# EAGLE board Adafruit Feather M0 RFMxx (EAGLE 9.6.2)
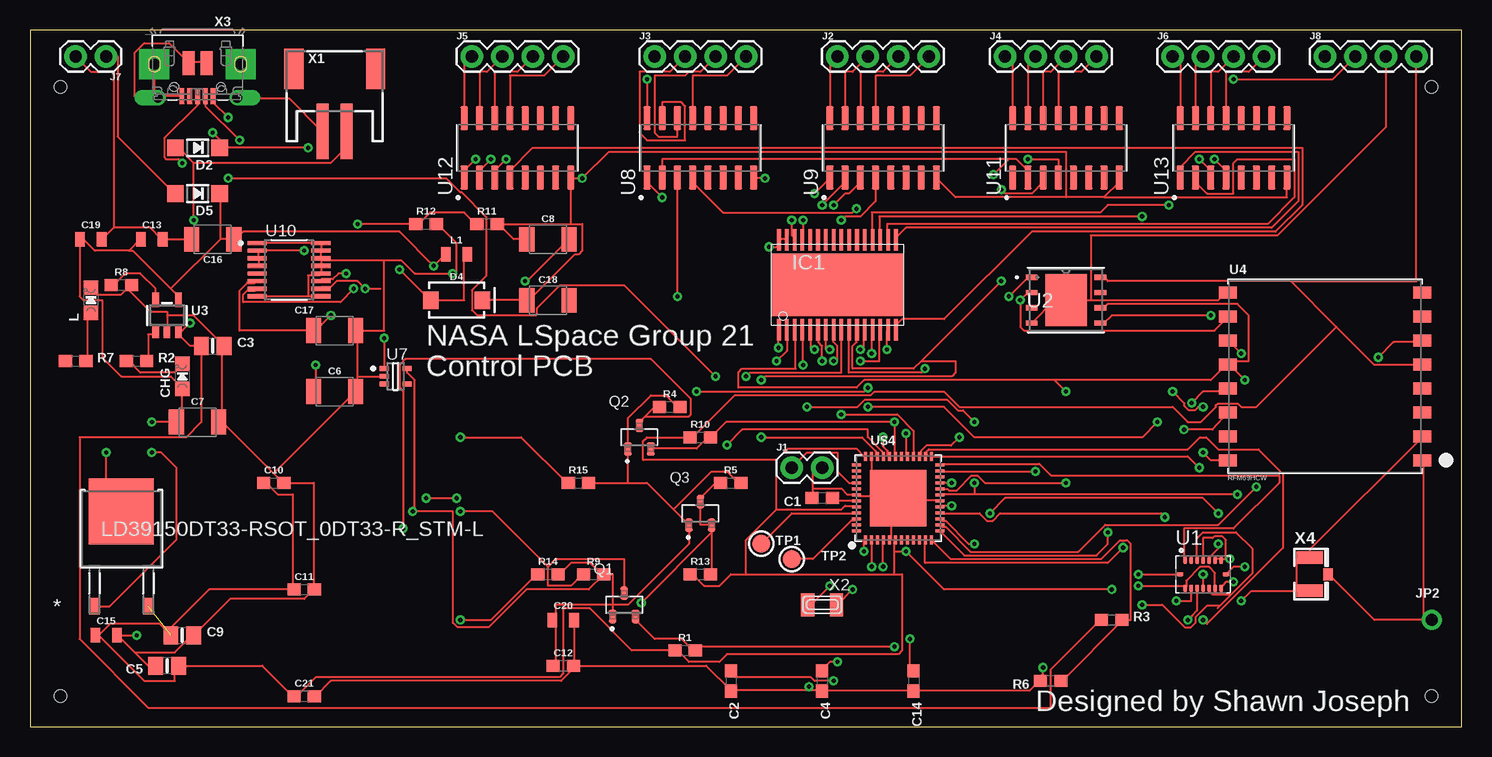
[diagram p1: board, top side]
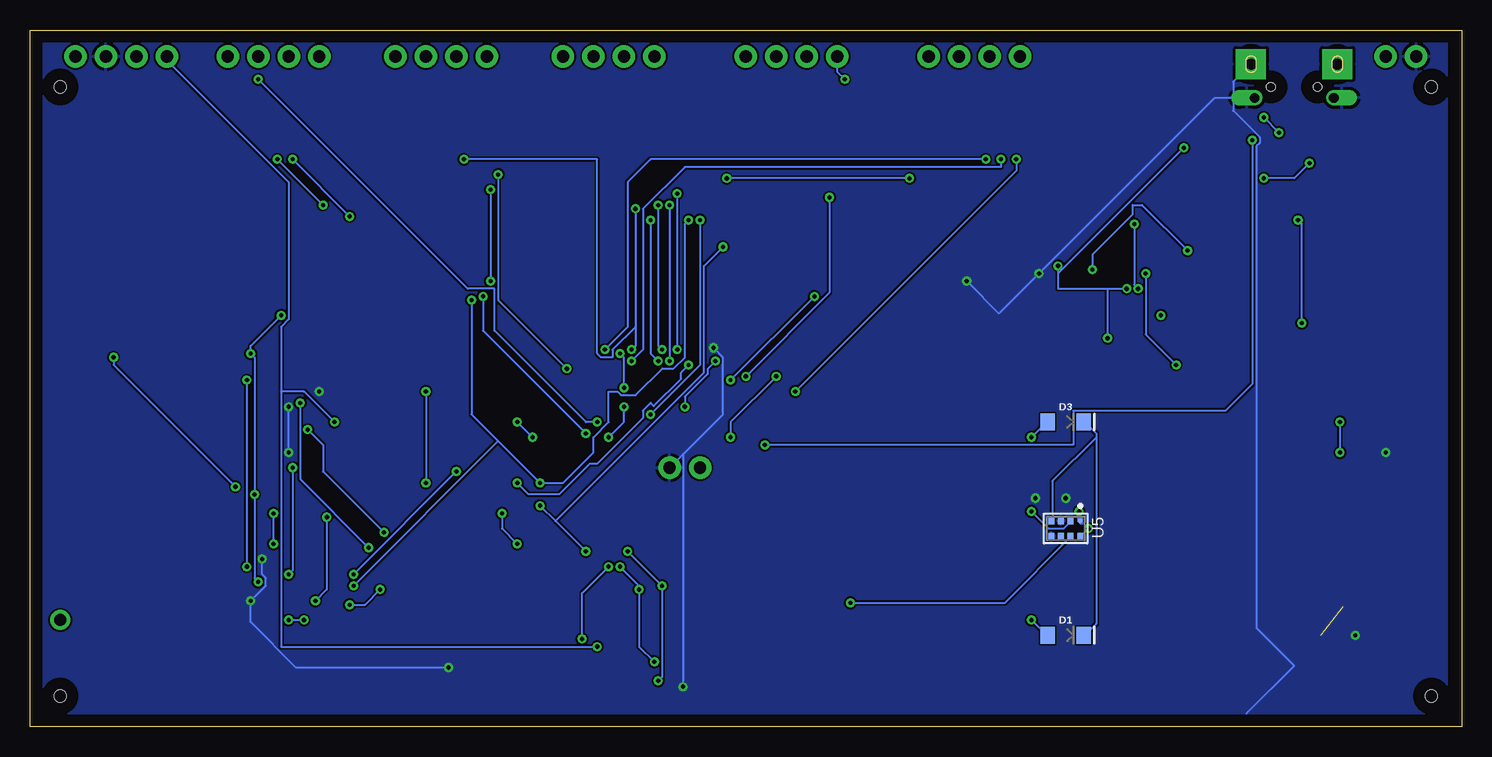
[diagram p2: board, bottom side, seen from below]

Size 119.36 x 58.09 mm. Coordinates in mm from the lower left corner, seen from the top.
Outline: 0,0 119.36,0 119.36,58.09 0,58.09 0,0
Copper layers (1*16): Top 0.035mm / dielectric 1.5mm / Bottom 0.035mm
Design rules "default": minimum track width 6mil, minimum drill 0.35mm, track to track 6mil, track to pad 6mil, pad to pad 6mil, via to via 6mil, smd to smd 6mil, copper to edge 40mil, drill to drill 6mil, minimum pad ring 10mil, minimum via ring 8mil, stop-mask expansion 4mil, vias tented up to drill 0mil, thermal gap 10mil
Holes 1 mm at 2.54,53.34 2.54,2.54 116.84,2.54 116.84,53.34

## Footprints (pad centres in the part's own frame; a part is rotated, then mirrored left to right if it is on the bottom)
0603-NO = smd 1.1 x 1: 1 -0.85,0; 2 0.85,0
0805-NO = smd 1.24 x 1.5: 1 -0.95,0; 2 0.95,0
1210 = smd 1.27 x 2.06: 1 -1.755,0; 2 1.755,0
0603 = smd 1.1 x 1: 1 -0.85,0; 2 0.85,0
0805 = smd 0.8 x 1.2: 1 -0.9,0; 2 0.9,0
CHIPLED_0805_NOOUTLINE = smd 1.2 x 1.2: A 0,-1.05; C 0,1.05
LED-1206 = smd 1.2 x 1.4: A -1.5,0; C 1.5,0
SOD-123 = smd 1.4 x 1.4: A 1.85,0; C -1.85,0
SMA-DIODE = smd 1.27 x 1.47: A -2.15,0; C 2.15,0
HTSSOP32DAP = smd 0.3 x 1.8: 1 -4.875,-3.75; 2 -4.225,-3.75; 3 -3.575,-3.75; 4 -2.925,-3.75; 5 -2.275,-3.75; 6 -1.625,-3.75; 7 -0.975,-3.75; 8 -0.325,-3.75; 9 0.325,-3.75; 10 0.975,-3.75; 11 1.625,-3.75; 12 2.275,-3.75; 13 2.925,-3.75; 14 3.575,-3.75; 15 4.225,-3.75; 16 4.875,-3.75; 17 4.875,3.75; 18 4.225,3.75; 19 3.575,3.75; 20 2.925,3.75; 21 2.275,3.75; 22 1.625,3.75; 23 0.975,3.75; 24 0.325,3.75; 25 -0.325,3.75; 26 -0.975,3.75; 27 -1.625,3.75; 28 -2.275,3.75; 29 -2.925,3.75; 30 -3.575,3.75; 31 -4.225,3.75; 32 -4.875,3.75 | smd 11 x 5.2: EXP 0,0
1X02 = drill 1.016 pad 1.88: 1 0,0; 2 2.54,0
1X04 = drill 1.016 pad 1.88: 1 0,0; 2 2.54,0; 3 5.08,0; 4 7.62,0
1X01_ROUND = drill 1 pad 1.676: 1 0,0
SOT23-3 = smd 0.62 x 1.1: 1 -0.95,-0.975; 2 0.95,-0.975; 3 0,0.975
TESTPOINT_ROUND_1.5MM = smd 1.5 x 1.5: P$1 0,0
PQFN50P450X300X100-16N = smd 0.35 x 0.58: 1 -1.5,1.16; 2 -1,1.16; 3 -0.5,1.16; 4 0,1.16; 5 0.5,1.16; 6 1,1.16; 7 1.5,1.16; 9 1.5,-1.16; 10 1,-1.16; 11 0.5,-1.16; 12 0,-1.16; 13 -0.5,-1.16; 14 -1,-1.16; 15 -1.5,-1.16 | smd 0.58 x 0.35: 8 1.91,0; 16 -1.91,0
WSON-8_6X5_WIN = smd 0.965 x 0.432: 1 -2.87,1.905; 2 -2.87,0.635; 3 -2.87,-0.635; 4 -2.87,-1.905; 5 2.87,-1.905; 6 2.87,-0.635; 7 2.87,0.635; 8 2.87,1.905 | smd 3.454 x 4.343: 9 0,0
SOT23-5 = smd 0.55 x 1.2: 1 -0.95,-1.3; 2 0,-1.3; 3 0.95,-1.3; 4 0.95,1.3; 5 -0.95,1.3
RFMHCW_SMT = smd 1.5 x 1: 1P 8.1,-7; 2P 8.1,-5; 3P 8.1,-3; 4P 8.1,-1; 5P 8.1,1; 6P 8.1,3; 7P 8.1,5; 8P 8.1,7; 9P -8.1,7; 10P -8.1,5; 11P -8.1,3; 12P -8.1,1; 13P -8.1,-1; 14P -8.1,-3; 15P -8.1,-5; 16P -8.1,-7
AMS_AS7341-DLGM_0 = smd 0.414 x 0.414: 1 -0.681,1.2 | smd 0.575 x 0.488: 2 -0.638,0.4; 3 -0.638,-0.4; 4 -0.638,-1.2; 5 0.638,-1.2; 6 0.638,-0.4; 7 0.638,0.4; 8 0.638,1.2
SOT_0DT33-R_STM-L = smd 0.889 x 1.397: 1 -2.25,-6.464; 3 2.25,-6.464 | smd 5.41 x 5.512: 2 0,1.435
MICROCHIP_MIC5365-2_5YC5-TR_0 = smd 0.75 x 0.4: 1 -0.95,0.65; 2 -0.95,0; 3 -0.95,-0.65; 4 0.95,-0.65; 5 0.95,0.65
SOIC127P600X175-16N = smd 1.97 x 0.6: 1 -2.475,4.445; 2 -2.475,3.175; 3 -2.475,1.905; 4 -2.475,0.635; 5 -2.475,-0.635; 6 -2.475,-1.905; 7 -2.475,-3.175; 8 -2.475,-4.445; 9 2.475,-4.445; 10 2.475,-3.175; 11 2.475,-1.905; 12 2.475,-0.635; 13 2.475,0.635; 14 2.475,1.905; 15 2.475,3.175; 16 2.475,4.445
MAXIM_MAX618EEE+_0 = smd 1.6 x 0.36: 1 -2.655,2.222; 2 -2.655,1.587; 3 -2.655,0.952; 4 -2.655,0.318; 5 -2.655,-0.318; 6 -2.655,-0.952; 7 -2.655,-1.587; 8 -2.655,-2.222; 9 2.655,-2.222; 10 2.655,-1.587; 11 2.655,-0.952; 12 2.655,-0.318; 13 2.655,0.318; 14 2.655,0.952; 15 2.655,1.587; 16 2.655,2.222
TQFN48_7MM = smd 0.25 x 0.75: 1 -2.75,-3.475; 2 -2.25,-3.475; 3 -1.75,-3.475; 4 -1.25,-3.475; 5 -0.75,-3.475; 6 -0.25,-3.475; 7 0.25,-3.475; 8 0.75,-3.475; 9 1.25,-3.475; 10 1.75,-3.475; 11 2.25,-3.475; 12 2.75,-3.475; 25 2.75,3.475; 26 2.25,3.475; 27 1.75,3.475; 28 1.25,3.475; 29 0.75,3.475; 30 0.25,3.475; 31 -0.25,3.475; 32 -0.75,3.475; 33 -1.25,3.475; 34 -1.75,3.475; 35 -2.25,3.475; 36 -2.75,3.475 | smd 0.75 x 0.25: 13 3.475,-2.75; 14 3.475,-2.25; 15 3.475,-1.75; 16 3.475,-1.25; 17 3.475,-0.75; 18 3.475,-0.25; 19 3.475,0.25; 20 3.475,0.75; 21 3.475,1.25; 22 3.475,1.75; 23 3.475,2.25; 24 3.475,2.75; 37 -3.475,2.75; 38 -3.475,2.25; 39 -3.475,1.75; 40 -3.475,1.25; 41 -3.475,0.75; 42 -3.475,0.25; 43 -3.475,-0.25; 44 -3.475,-0.75; 45 -3.475,-1.25; 46 -3.475,-1.75; 47 -3.475,-2.25; 48 -3.475,-2.75 | smd 4.7 x 4.7: THERMAL 0,0
JSTPH2 = smd 1 x 4.6: 1 -1,-3.7; 2 1,-3.7 | smd 1.6 x 3.4: NC1 -3.4,1.5; NC2 3.4,1.5
XTAL3215 = smd 1.1 x 1.9: P$1 1.2,0; P$2 -1.2,0
4UCONN_20329_V2 = smd 1 x 2: BASE@1 -0.75,-2; BASE@2 0.75,-2 | smd 0.4 x 1.35: D+ 0,0.775; D- -0.65,0.775; GND 1.3,0.775; ID 0.65,0.775; VBUS -1.3,0.775 | drill 0.8 pad 1.2 offset: SPRT@1 -3.3,0.9; SPRT@2 3.3,0.9 | drill 0.9 pad 2.5 square: SPRT@3 -3.6,-1.9; SPRT@4 3.6,-1.9 | hole 0.7: -1.95,0; 1.95,0
U.FL = smd 2.2 x 1.05: 1 0,1.375; 2 0,-1.375 | smd 0.8 x 1: 3 1.525,0

## Placement (x,y rotation side)
C1  1uF  [0603-NO]  66.04,19.05 180 top
C2  22pF  [0603-NO]  58.42,3.81 270 top
C3  10µF  [0805-NO]  15.24,31.75 0 top
C4  22pF  [0603-NO]  66.04,3.81 270 top
C5  10uF  [0805-NO]  11.43,5.08 180 top
C6  22UF-1210-16V-20%  [1210]  25.4,27.94 0 top
C7  22UF-1210-16V-20%  [1210]  13.97,25.4 0 top
C8  22UF-1210-16V-20%  [1210]  43.18,40.64 0 top
C9  10uF  [0805-NO]  12.7,7.62 0 top
C10  0.1uF  [0603]  20.32,20.32 0 top
C11  0.1uF  [0603]  22.86,11.43 0 top
C12  0.1uF  [0603]  44.45,5.08 0 top
C13  1.0uF  [0805]  10.16,40.64 0 top
C14  1uF  [0603-NO]  73.66,3.81 270 top
C15  2.2uF  [0805]  6.35,7.62 0 top
C16  22UF-1210-16V-20%  [1210]  15.24,40.64 180 top
C17  22UF-1210-16V-20%  [1210]  25.4,33.02 0 top
C18  22UF-1210-16V-20%  [1210]  43.18,35.56 0 top
C19  1.0uF  [0805]  5.08,40.64 0 top
C20  1.0uF  [0805]  44.45,8.89 0 top
C21  0.1uF  [0603]  22.86,2.54 0 top
CHG  ORANGE  [CHIPLED_0805_NOOUTLINE]  12.7,29.21 0 top
D1  [LED-1206]  33.02,7.62 0 bottom
D2  MBR120  [SOD-123]  13.97,48.26 180 top
D3  [LED-1206]  33.02,25.4 0 bottom
D4  3A/40V/500mV  [SMA-DIODE]  35.56,35.56 0 top
D5  MBR120  [SOD-123]  13.97,44.45 180 top
IC1  TLC5947-DAP  [HTSSOP32DAP]  67.31,36.83 0 top
J1  [1X02]  63.5,21.59 0 top
J2  [1X04]  67.31,55.88 0 top
J3  [1X04]  52.07,55.88 0 top
J4  [1X04]  81.28,55.88 0 top
J5  [1X04]  36.83,55.88 0 top
J6  [1X04]  95.25,55.88 0 top
J7  [1X02]  6.35,55.88 180 top
J8  [1X04]  107.95,55.88 0 top
JP2  [1X01_ROUND]  116.84,8.89 0 top
L  RED  [CHIPLED_0805_NOOUTLINE]  5.08,35.56 0 top
L1  3.3µH/±20%/450mA  [0805]  35.56,39.37 0 top
Q1  BSS138  [SOT23-3]  49.53,10.16 0 top
Q2  BSS138  [SOT23-3]  50.8,24.13 0 top
Q3  BSS138  [SOT23-3]  55.88,17.78 0 top
R1  10k  [0603]  54.61,6.35 0 top
R2  1K  [0603-NO]  8.89,30.48 0 top
R3  100k  [0603-NO]  90.17,8.89 0 top
R4  4.7k  [0603]  53.34,26.67 0 top
R5  4.7k  [0603]  58.42,20.32 0 top
R6  100K  [0603-NO]  85.09,3.81 180 top
R7  2.2K  [0603-NO]  3.81,30.48 0 top
R8  1k  [0603]  7.62,36.83 0 top
R9  4.7k  [0603]  46.99,12.7 0 top
R10  10k  [0603]  55.88,24.13 0 top
R11  150k  [0603]  38.1,41.91 0 top
R12  20k  [0603]  33.02,41.91 0 top
R13  10k  [0603]  55.88,12.7 0 top
R14  1k  [0603]  43.18,12.7 0 top
R15  1k  [0603]  45.72,20.32 0 top
TP1  [TESTPOINT_ROUND_1.5MM]  60.96,15.24 0 top
TP2  [TESTPOINT_ROUND_1.5MM]  63.5,13.97 0 top
U1  BMI085  [PQFN50P450X300X100-16N]  97.79,12.7 0 top
U2  W25N01GVZEIG  [WSON-8_6X5_WIN]  86.36,35.56 0 top
U3  MCP73831T-2ACI/OT  [SOT23-5]  11.43,34.29 0 top
U4  RFM69HCW  [RFMHCW_SMT]  107.95,29.21 0 top
U5  AMS_AS7341-DLGMAMS_AS7341-DLGM_0_0  [AMS_AS7341-DLGM_0]  33.02,16.51 270 bottom
U6  LD39150DT33-RSOT_0DT33-R_STM-L  [SOT_0DT33-R_STM-L]  7.62,16.51 0 top
U7  MICROCHIP_MIC5365-2_5YC5-TRMICROCHIP_MIC5365-2_5YC5-TR_0_0  [MICROCHIP_MIC5365-2_5YC5-TR_0]  30.48,29.21 0 top
U8  SN75468D  [SOIC127P600X175-16N]  55.88,48.26 90 top
U9  SN75468D  [SOIC127P600X175-16N]  71.12,48.26 90 top
U10  MAXIM_MAX618EEE+MAXIM_MAX618EEE+_0_0  [MAXIM_MAX618EEE+_0]  21.59,38.1 0 top
U11  SN75468D  [SOIC127P600X175-16N]  86.36,48.26 90 top
U12  SN75468D  [SOIC127P600X175-16N]  40.64,48.26 90 top
U13  SN75468D  [SOIC127P600X175-16N]  100.33,48.26 90 top
U$4  ATSAMD21G18_QFN  [TQFN48_7MM]  72.39,19.05 0 top
X1  JSTPH  [JSTPH2]  25.4,53.34 0 top
X2  32.768  [XTAL3215]  66.04,10.16 180 top
X3  microUSB  [4UCONN_20329_V2]  13.97,53.34 180 top
X4  uFL  [U.FL]  106.68,12.7 0 top

## Tracks (layer width: path | path; a pad name or v marks a point on that pad's centre or on a via)
1V8  (via drill 0.35)
  Top 0.152: 43.81,8.89 43.81,5.08 C12.1 | R14.2 44.13,12.7 45.09,13.65 46.67,13.65 47.62,12.7 R9.2 | 48.58,10.16 48.58,12.7 R9.2 | 48.58,10.16 48.58,9.21 Q1.1 | 43.81,8.89 43.81,10.16 48.58,10.16 | 43.81,8.89 C20.1 | 53.66,18.1 51.44,20.32 49.85,20.32 | 53.66,18.1 54.93,16.83 Q3.1 54.93,16.51 54.93,15.24 49.85,10.16 48.58,10.16 | R15.2 49.85,20.32 | 53.66,18.1 56.83,21.27 58.1,21.27 59.05,20.32 R5.2 | 49.85,20.32 49.85,22.86 Q2.1 49.85,23.18 49.85,25.72 51.75,27.62 53.02,27.62 53.98,26.67 R4.2 | R9.2 46.57,11.43 41.39,11.43 38.24,8.28 35.63,8.28 35.27,8.64 35.27,17.94 32.07,17.94 | 32.07,17.94 32.07,28.89 31.43,29.53 31.43,29.84 U7.5 | 32.07,17.94 v31.91,17.94
  Bottom 0.152: U5.1 31.75,17.26 31.75,17.78 v31.91,17.94
3V3  (via drill 0.35)  (1 unrouted)
  Top 0.152: 105.09,37.15 89.85,37.15 89.53,37.47 U2.8 | 108.9,33.34 112.08,30.16 115.89,30.16 U4.5P | 108.9,33.34 105.09,37.15 | J8.4 115.57,37.15 105.09,37.15 | 5.71,7.62 6.67,8.57 10.79,8.57 11.43,7.94 | 11.43,7.94 C9.1 | 21.91,11.43 21.91,19.37 20.64,19.37 19.68,20.32 C10.1 | 11.59,8.1 11.43,7.94 | 21.91,11.43 14.92,11.43 11.59,8.1 | 21.91,11.43 C11.1 | 5.71,7.62 9.53,3.81 12.06,3.81 12.06,5.08 C5.1 19.37,5.08 21.91,2.54 C21.1 22.23,2.54 23.81,4.13 44.13,4.13 44.45,4.45 44.45,9.84 46.67,9.84 50.16,6.35 R1.1 53.98,6.35 54.93,5.4 57.47,5.4 58.1,6.03 72.39,6.03 72.71,6.35 72.71,12.7 72.07,12.7 | 5.71,7.62 C15.1 | IC1.31 63.18,40.64 62.55,40.64 IC1.32 62.55,40.32 62.23,40.01 v61.59,40.01 | 72.07,12.7 72.07,14.61 | 72.07,14.61 72.07,15.56 U$4.6 | 59.69,12.7 58.42,12.7 57.47,11.75 56.2,11.75 55.24,12.7 R13.1 | 59.69,12.7 72.07,12.7 | 62.23,18.1 67.63,18.1 67.94,18.42 68.9,18.42 U$4.44 | 62.23,18.1 59.69,15.56 59.69,12.7 | v76.83,18.42 75.88,18.42 U$4.17 | 72.07,14.61 v73.03,14.61 76.2,11.43 v90.17,11.43 | 62.23,22.23 63.18,23.18 68.9,23.18 69.53,22.54 U$4.36 | 62.23,18.1 62.23,22.23 | 62.23,22.23 51.12,22.23 51.12,23.81 51.44,24.13 R10.1 55.24,24.13 58.75,27.64 70.09,27.64 70.39,27.94 76.2,27.94 77.47,26.67 95.25,26.67 96.52,25.4 97.6,25.4 98.87,26.67 98.87,26.81 99,26.94 100.69,26.94 100.96,26.67 102.23,26.67 108.9,33.34 | 97.39,14.19 97.39,13.96 U1.3 97.29,15.71 97.79,16.21 100.54,16.21 101.89,14.86 101.89,12.77 100.14,11.02 | 100.14,11.02 98.57,11.02 98.39,11.21 98.39,11.44 U1.11 | 100.14,11.02 99.17,10.05 | 99.17,10.05 98.99,9.87 | 99.17,10.05 98.09,10.05 97.18,9.14 97.18,8.7 96.77,8.28 96.27,8.28 94.39,10.16 v92.71,10.16
  Top 0.152: 11.59,8.1 | 11.43,7.94 C9.1 | 11.59,8.1 C9.1
  Bottom 0.152: v73.03,14.61 75.56,17.15 | 75.56,17.15 v76.83,18.42 | v61.59,40.01 63.18,38.42 63.18,29.53 75.56,17.15 | v92.71,10.16 91.44,10.16 v90.17,11.43
12V  (via drill 0.35)
  Top 0.152: 89.53,44.13 86.36,44.13 | 86.36,44.13 77.15,44.13 75.56,45.72 U9.8 | 89.53,44.13 90.81,45.4 U11.8 | U13.8 104.78,44.13 89.53,44.13 | D4.C C18.1 41.59,35.56 45.4,39.37 45.72,39.37 46.04,39.69 46.04,41.91 45.09,41.91 | 39.05,41.91 40.32,40.64 C8.1 | 45.09,41.91 45.09,45.72 | 39.05,41.91 45.09,41.91 | 39.05,41.91 R11.2 | v61.28,45.72 60.33,45.72 U8.8 | 45.09,45.72 v46.04,45.72 48.26,47.94 86.36,47.94 86.36,44.13 | 45.09,45.72 U12.8
  Bottom 0.152: v46.04,45.72 v61.28,45.72
!RESET
  Top 0.152: J1.1 64.77,22.86 67.31,22.86 67.31,21.27 68.26,20.32 68.9,20.32 U$4.40
ANT
  Top 0.152: 116.2,8.89 112.08,8.89 108.27,12.7 X4.3 | 116.2,8.89 116.2,21.91 U4.1P | 116.2,8.89 JP2.1
AREF  (via drill 0.35)
  Top 0.152: v71.12,13.34 71.12,15.56 U$4.4 | v73.34,7.3 73.34,4.76 73.66,4.76 C14.1
  Bottom 0.152: v71.12,13.34 73.34,11.11 v73.34,7.3
AS7341_INT  (via drill 0.35)
  Top 0.152: R5.1 57.15,20.32 55.88,19.05 Q3.3 55.88,16.83 56.83,16.83 Q3.2 56.83,16.51 56.83,16.19 | 56.83,16.19 56.83,12.7 R13.2 | 56.83,16.19 v50.96,10.32
  Bottom 0.152: v50.96,10.32 38.1,10.32 32.7,15.72 U5.7
BLK  (via drill 0.35)
  Top 0.152: IC1.2 63.09,31.34 v62.23,30.48 | v78.74,25.4 77.78,26.37 77.34,26.37 76.43,27.28 69.6,27.28 68.99,26.67 v64.77,26.67 | v77.47,24.13 76.77,23.43 74.72,23.43 74.29,23 74.29,22.67 U$4.27
  Bottom 0.152: v62.23,30.48 62.88,29.83 62.88,29.4 64.77,27.51 v64.77,26.67 | v78.74,25.4 v77.47,24.13
BMI085_INT1_ACCEL  (via drill 0.35)
  Top 0.152: v92.39,12.7 U1.16 | v83.82,21.27 75.88,21.27 U$4.23
  Bottom 0.152: v83.82,21.27 v92.39,12.7
BMI085_INT2_ACCEL
  Top 0.152: U1.1 96.2,13.97 96.2,16.51 100.33,16.51 104.14,20.32 104.14,20.96 85.09,20.96 84.14,21.91 75.88,21.91 U$4.24
BMI085_INT3_GYRO  (via drill 0.35)
  Top 0.152: v97.79,12.7 U1.12 | v97.47,21.59 96.52,22.54 75.25,22.54 U$4.25
  Bottom 0.152: v97.79,12.7 97.47,13.02 v97.47,21.59
BMI085_INT4_GYRO  (via drill 0.35)
  Top 0.152: U$4.26 74.79,22.67 74.79,23 74.92,23.13 96.52,23.13 97.52,24.13 98.06,24.13 99.06,23.13 102.4,23.13 104.44,21.08 104.44,14.89 98.12,8.56 v97.79,8.89 | U1.13 97.29,9.68 96.88,9.27 96.88,9.25 v96.52,8.89
  Bottom 0.152: v97.79,8.89 v96.52,8.89
CSB_ACCEL  (via drill 0.35)
  Top 0.152: v95.57,10.48 96.79,10.48 U1.14 | v94.61,17.46 94.3,17.78 80.87,17.78 80.26,17.17 79.76,17.17 79.15,17.78 75.89,17.78 U$4.16 75.88,17.78
  Bottom 0.152: v95.57,10.48 94.61,11.43 v94.61,17.46
CSB_GYRO  (via drill 0.35)
  Top 0.152: U1.5 98.39,13.96 98.39,14.19 99.06,14.87 v99.06,15.24 | v99.06,17.78 97.79,19.05 81.28,19.05 v80.01,17.78 | U$4.15 76.01,17.15 76.33,17.15 78.25,15.24 v78.74,15.24
  Bottom 0.152: v99.06,15.24 v99.06,17.78 | v80.01,17.78 80.01,16.51 v78.74,15.24
CTR0_0  (via drill 0.35)
  Top 0.152: v65.41,31.43 65.09,31.43 65.09,33.02 IC1.5 | v65.41,44.45 66.67,45.72 U9.1
  Bottom 0.152: v65.41,44.45 v65.41,31.43
CTR0_1  (via drill 0.35)
  Top 0.152: v66.04,30.48 66.04,31.75 65.72,32.07 65.72,33.02 IC1.6 | v66.04,43.5 67.94,45.4 U9.2
  Bottom 0.152: v66.04,43.5 v66.04,30.48
CTR0_2  (via drill 0.35)
  Top 0.152: v66.67,31.43 66.36,31.43 66.36,33.02 IC1.7 | v66.99,43.5 67.94,44.45 68.26,44.45 69.22,45.4 U9.3
  Bottom 0.152: v66.67,31.43 66.99,31.75 v66.99,43.5
CTR0_3  (via drill 0.35)
  Top 0.152: v66.99,30.48 67.31,30.48 67.31,31.75 66.99,32.07 66.99,33.02 IC1.8 | v67.63,42.23 67.94,42.55 69.22,42.55 70.48,43.81 U9.4
  Bottom 0.152: v66.99,30.48 67.63,31.12 v67.63,42.23
CTR1_0  (via drill 0.35)
  Top 0.152: v59.69,29.21 60.01,29.53 67.63,29.53 67.63,33.02 IC1.9 | v52.7,44.13 51.44,45.4 U8.1
  Bottom 0.152: v59.69,29.21 52.7,36.2 v52.7,44.13
CTR1_1  (via drill 0.35)
  Top 0.152: v74.61,29.84 74.3,29.53 68.26,29.53 68.26,33.02 IC1.10 | 81.6,47.31 v80.33,46.04 | 81.6,47.31 82.23,47.31 83.19,46.36 U11.2 | U8.2 52.7,47.31 81.6,47.31
  Bottom 0.152: v74.61,29.84 80.33,35.56 v80.33,46.04
CTR1_2  (via drill 0.35)
  Top 0.152: v80.96,37.15 74.3,30.48 | 74.3,30.48 73.66,29.84 68.58,29.84 68.58,31.75 68.9,32.07 68.9,33.02 IC1.11 | v80.96,44.77 81.28,44.45 83.5,44.45 84.45,45.4 U11.3 | v53.98,35.88 U8.3 | v60.96,28.89 61.28,29.21 76.83,29.21 77.15,29.53 77.15,30.48 74.3,30.48
  Bottom 0.152: v80.96,44.77 v80.96,37.15 | v60.96,28.89 v53.98,35.88
CTR1_3  (via drill 0.35)
  Top 0.152: v69.22,31.43 69.53,31.43 69.53,33.02 IC1.12 | v68.9,43.18 68.58,42.86 57.78,42.86 55.24,45.4 U8.4 | U11.4 85.72,47.31 v83.19,47.31
  Bottom 0.152: v69.22,31.43 68.9,31.75 68.9,33.34 | v68.9,43.18 68.9,33.34 | v83.19,47.31 72.07,47.31 72.07,31.12 71.75,30.8 70.8,30.8 70.8,31.43 68.9,33.34
CTR2_0  (via drill 0.35)
  Top 0.152: v70.17,31.12 70.17,33.02 IC1.13 | v69.85,28.26 69.53,27.94 v55.56,27.94 | v37.15,47.31 36.2,46.36 U12.1
  Bottom 0.152: v70.17,31.12 69.85,30.8 v69.85,28.26 | v55.56,27.94 37.15,46.36 v37.15,47.31
CTR2_1  (via drill 0.35)
  Top 0.152: v69.22,30.48 70.8,30.48 70.8,33.02 IC1.14 | v38.42,47.31 37.47,46.36 U12.2
  Bottom 0.152: v69.22,30.48 68.26,31.43 68.26,43.18 64.77,46.67 38.42,46.67 v38.42,47.31
CTR2_2  (via drill 0.35)
  Top 0.152: v71.44,31.43 71.44,33.02 IC1.15 | v39.69,47.31 38.73,46.36 U12.3
  Bottom 0.152: v71.44,31.43 69.53,33.34 69.53,45.4 67.63,47.31 v39.69,47.31
CTR2_3
  Top 0.152: U12.4 40.01,46.36 41.91,48.26 106.05,48.26 106.05,43.5 103.82,41.28 83.5,41.28 76.2,33.97 72.71,33.97 72.07,33.34 IC1.16
CTR3_0
  Top 0.152: U13.1 95.89,46.67 97.16,47.94 105.73,47.94 105.73,43.81 103.5,41.59 73.03,41.59 72.07,40.64 IC1.17
CTR3_1
  Top 0.152: U13.2 97.16,45.4 98.11,44.45 100.33,44.45 100.33,46.99 100.65,47.31 105.41,47.31 105.41,44.13 103.19,41.91 71.44,41.91 71.44,40.64 IC1.18
CTR3_2  (via drill 0.35)
  Top 0.152: v92.71,42.55 70.8,42.55 70.8,40.64 IC1.19 | v97.47,47.31 98.42,46.36 U13.3
  Bottom 0.152: v97.47,47.31 v92.71,42.55
CTR3_3  (via drill 0.35)
  Top 0.152: v94.93,43.5 89.85,43.5 89.22,42.86 70.17,42.86 70.17,40.64 IC1.20 | v98.74,47.31 99.69,46.36 U13.4
  Bottom 0.152: v98.74,47.31 v94.93,43.5
D3_IRQ  (via drill 0.35)
  Top 0.152: v102.23,20 99.06,16.83 89.63,16.83 87.38,14.58 78.41,14.58 76.33,16.65 76.01,16.65 U$4.14 | v112.39,30.8 113.67,32.07 115.89,32.07 U4.6P
  Bottom 0.152: v102.23,20 112.39,30.16 v112.39,30.8
D4_RST  (via drill 0.35)
  Top 0.152: v96.2,24.77 98.57,24.77 U4.14P | U$4.13 77.89,14.28 88.9,14.28 89.85,15.23 v89.85,16.19
  Bottom 0.152: v89.85,16.19 94.93,21.27 94.93,23.5 v96.2,24.77
D8_CS  (via drill 0.35)
  Top 0.152: v91.12,14.92 89.85,13.65 74.61,13.65 74.61,15.56 U$4.11 | v96.84,26.99 97.79,27.94 99.69,27.94 U4.13P
  Bottom 0.152: v91.12,14.92 96.84,20.64 v96.84,26.99
D9
  Top 0.152: 91.12,8.89 91.76,8.89 91.76,15.24 91.44,15.56 91.41,15.53 90.87,15.53 89.31,13.97 76.75,13.97 U$4.12 | 91.12,8.89 86.04,3.81 R6.1 | 91.12,8.89 R3.2
D+  (via drill 0.35)
  Top 0.152: X3.D+ 13.97,51.83 11.19,49.06 11.19,47.47 11.32,47.33 12.36,47.33 v12.7,46.99 | v16.51,45.72 34.7,45.72 35.84,44.57 35.96,44.57 38.03,42.51 38.03,37.57 36.85,36.39 36.85,34.73 37.27,34.3 42.16,34.3 42.29,34.44 42.29,34.9 44.2,36.82 49.54,36.82 v57.15,29.21 | U$4.34 70.49,22.67 70.49,23 69.36,24.13 v60.96,24.13
  Bottom 0.152: v12.7,46.99 13.97,45.72 v16.51,45.72 | v57.15,29.21 60.96,25.4 v60.96,24.13
D-  (via drill 0.35)
  Top 0.152: v58.1,23.5 59.37,24.77 69.85,24.77 69.85,24.14 70.99,23 70.99,22.99 71.12,22.86 71.12,22.54 U$4.33 | v17.46,48.9 14.61,51.75 14.61,52.39 X3.D-
  Bottom 0.152: v58.1,23.5 32.38,23.5 32.38,26.35 19.68,26.35 17.46,28.58 v17.46,48.9
FB  (via drill 0.35)
  Top 0.152: R11.1 37.15,41.91 36.2,42.86 33.34,42.86 32.38,41.91 R12.1 v27.3,41.91 | U10.7 18.89,36.51 18.73,36.35 18.1,36.35 17.78,36.04 17.78,35.4 25.88,35.4 v26.99,36.51
  Bottom 0.152: v26.99,36.51 27.3,36.83 v27.3,41.91
FLASH_CS  (via drill 0.35)
  Top 0.152: v73.03,24.45 73.03,22.54 U$4.29 | v81.6,35.88 83.19,37.47 U2.1
  Bottom 0.152: v73.03,24.45 81.6,33.02 v81.6,35.88
GND  (via drill 0.35, 0.35 pad 0.27)
  Top 0.152: U1.4 97.79,15.72 98.58,15.72 98.74,15.88 99.38,15.88 99.69,15.56 99.69,13.97 | 99.69,13.97 99.38,13.97 U1.7 99.22,13.97 98.9,13.97 U1.6 | v100.01,13.97 99.69,13.97 | v100.97,10.48 101.76,11.27 105.57,11.27 | 105.57,11.27 106.68,11.27 X4.2 | U4.2P 116.05,24.13 106.68,14.76 X4.1 106.68,13.97 105.57,13.97 105.57,11.27 | 66.04,3.02 64.93,3.02 | 64.93,3.02 58.42,3.02 | 66.04,3.02 73.66,3.02 | 66.04,3.02 C4.2 | 73.66,3.02 83.34,3.02 84.14,3.81 R6.2 84.45,3.81 v84.45,4.92 | 73.66,3.02 C14.2 | C21.2 23.81,2.54 25.08,3.81 44.29,3.81 45.24,4.76 45.24,5.08 C12.2 45.4,5.08 | 45.4,5.08 45.4,8.89 C20.2 | 58.42,3.02 56.36,5.08 45.4,5.08 | 58.42,3.02 C2.2 | U10.1 19.05,40.32 24.13,40.32 U10.16 24.29,40.16 24.29,39.69 U10.15 24.29,39.53 24.29,39.05 U10.14 24.29,38.89 | 23.18,35.88 24.13,35.88 U10.9 | 23.18,35.88 19.05,35.88 U10.8 | 24.29,38.89 29.53,38.89 | 29.53,38.89 30.96,38.89 32.07,37.78 v35.24,37.78 35.56,37.78 35.56,40.32 33.97,41.91 R12.2 | 24.29,38.89 24.29,38.58 U10.13 24.29,38.42 24.29,37.78 U10.12 24.13,37.62 23.18,37.62 23.18,35.88 | 27.3,29.21 27.3,27.94 C6.2 20.32,21.11 | 27.3,29.21 27.3,33.02 | v41.27,37.15 41.43,37.15 44.93,40.64 C8.2 | 29.53,38.89 29.53,33.02 27.3,33.02 | 27.3,33.02 C17.2 | 8.1,36.51 7.62,36.04 5.56,36.04 5.08,36.51 L.C | 8.1,36.51 8.41,36.83 R8.2 8.1,36.51 | 11.43,34.29 11.43,34.61 10,34.61 8.1,36.51 | 11.43,34.29 U3.2 | 8.73,6.19 9.84,5.08 C5.2 | 8.73,6.19 7.3,7.62 C15.2 v8.89,7.62 | 8.73,6.19 12.06,6.19 13.49,7.62 C9.2 16.67,10.64 22.86,10.64 23.65,11.43 | 16.03,25.4 20.32,21.11 | 20.32,21.11 21.11,20.32 C10.2 23.65,20.32 23.65,11.43 | 16.03,25.4 C7.2 15.88,25.4
  Top 0.152: 16.03,25.4 16.03,31.75 C3.2 13.65,34.29 11.43,34.29 | 23.65,11.43 C11.2 | U2.4 83.5,33.66 85.41,35.56 U2.9 88.42,35.56 | 88.42,35.56 99.06,35.56 99.69,36.2 U4.9P | 71.75,19.05 71.75,18.89 | 71.75,18.89 71.75,15.72 U$4.5 | 70.17,19.21 71.6,19.21 71.75,19.05 | 70.17,19.21 69.06,19.21 U$4.42 68.9,19.37 68.1,19.37 67.63,19.84 65.25,19.84 | 71.75,19.05 U$4.THERMAL | 70.17,19.21 70.17,22.38 U$4.35 | 70.17,19.21 U$4.THERMAL | 71.75,18.89 75.72,18.89 U$4.18 | 71.75,18.89 U$4.THERMAL | 6.99,41.59 6.03,40.64 C19.2 | 6.99,41.59 10,41.59 10.95,40.64 C13.2 C16.2 | X3.BASE@1 14.61,55.4 13.34,55.4 X3.BASE@2 13.18,55.4 11.59,56.99 9.53,56.99 8.73,56.2 8.73,52.55 10.16,52.55 | 65.25,19.84 65.25,21.59 J1.2 | 65.25,19.84 65.25,19.05 C1.2 | v62.39,31.59 62.39,33.02 IC1.1 | 10.64,52.55 10.16,52.55 | 10.64,52.55 X3.SPRT@2 | 6.99,41.59 6.99,54.61 5.08,54.61 J7.2 | X1.1 24.29,49.69 21.59,52.39 17.3,52.39 X3.SPRT@1 | 88.42,35.56 88.42,40.96 103.98,40.96 113.03,50.01 J8.3 | v64.93,3.33 64.93,3.02 | X3.SPRT@4 10.37,52.76 10.16,52.55 | 27.3,29.21 U7.2 | U4.16P 98.44,22.21 v97.79,22.86 | v97.79,26.67 97.38,26.67 97.09,26.38 96.59,26.38 96.23,26.74 96.23,26.96 v95.25,27.94 | X3.GND 10.65,52.56 10.64,52.55 | U6.2 7.46,17.95 6.35,19.05 v6.35,22.86 | v33.02,19.05 v35.56,19.05
  Bottom 0.152: v100.01,13.97 100.01,12.7 99.69,12.38 99.69,11.75 v100.97,10.48 100.97,8.73 97.16,4.92 v84.45,4.92 | v41.27,37.15 38.58,34.45 v35.24,37.78 20.64,52.39 17.3,52.39 X3.SPRT@1 | v62.39,31.59 61.59,30.8 61.59,26.03 64.93,22.7 | J1.2 64.93,22.7 | 64.93,22.7 v64.93,3.33 | v97.79,22.86 v97.79,26.67 | X3.SPRT@3 19.05,53.76 19.05,51.34 16.86,49.15 16.86,48.64 17.12,48.38 17.12,8.23 13.97,5.08 17.96,1.09
  pour Bottom: 1.27,57.15 1.27,0 115.57,0 116.84,1.27 119.38,3.81 119.38,57.15 2.54,57.15 1.27,58.42
LDR
  Bottom 0.152: 30.48,24.13 30.48,24.45 31.43,25.4 D3.C 32.08,24.84 | 30.48,24.13 30.48,8.57 31.43,7.62 D1.C | 30.48,24.13 34.13,20.48 34.13,17.3 U5.4
LX  (via drill 0.35)
  Top 0.152: L1.2 36.2,39.37 36.2,35.56 D4.A 33.34,35.56 v30.8,38.1 | U10.4 19.05,38.58 19.05,38.89 U10.3 19.05,39.05 19.05,39.53 U10.2 19.05,39.69 v22.86,39.69
  Bottom 0.152: 30.8,38.42 v30.8,38.1 30.8,39.37 27.46,42.7 27.46,43.5 26.67,43.5 v22.86,39.69
MISO  (via drill 0.35)
  Top 0.152: U1.10 98.79,12.81 98.29,13.31 97.54,13.31 96.39,12.16 96.39,11.64 U1.15 96.2,11.75 v92.39,11.75 | v76.83,20.32 75.88,20.32 U$4.21 | U2.2 83.19,36.2 v82.55,35.56 82.55,33.34 82.87,33.02 98.74,33.02 99.69,33.97 U4.10P | v64.45,42.23 64.45,40.64 IC1.29
  Bottom 0.152: 80.33,23.81 82.55,26.03 v82.55,35.56 | 80.33,23.81 v76.83,20.32 74.93,20.32 72.39,22.86 72.39,24.13 71.12,25.4 71.12,27.94 70.39,27.94 70.1,27.65 68.87,27.65 66.65,29.87 65.69,29.87 64.77,30.8 64.77,41.91 v64.45,42.23 | 80.33,23.81 v92.39,11.75
MOSI  (via drill 0.35)
  Top 0.152: v100.33,12.07 99.69,12.07 99.38,11.75 U1.9 | v100.97,31.12 100.01,32.07 U4.11P | v98.42,34.29 90.17,34.29 89.53,33.66 U2.5 | v64.45,30.16 64.45,33.02 IC1.4 | v100.65,19.37 78.74,19.37 | 78.74,19.37 75.88,19.37 U$4.19 | v78.74,20.32 78.74,19.37
  Bottom 0.152: v100.33,12.07 100.65,12.38 v100.65,19.37 100.65,30.8 v100.97,31.12 100.97,31.75 v98.42,34.29 | v64.45,30.16 65.09,29.53 65.09,29.01 67.37,26.73 67.63,26.99 68.26,26.35 68.26,25.72 72.07,21.91 72.71,21.91 75.25,19.37 77.79,19.37 v78.74,20.32
N$1
  Top 0.152: R2.1 8.26,30.48 9.21,29.53 12.06,29.53 12.7,30.16 CHG.C
N$2
  Top 0.152: R7.2 4.76,30.48 4.76,34.29 5.08,34.29 L.A
N$3
  Top 0.152: R2.2 9.84,30.48 9.84,32.7 10.48,32.7 U3.1
N$4
  Top 0.152: R8.1 6.99,36.83 7.94,37.78 9.21,37.78 10.48,36.51 10.48,35.88 U3.5
N$5  (via drill 0.35)
  Top 0.152: v69.53,14.61 69.53,15.56 U$4.1 | v66.67,11.75 65.09,10.16 X2.P$1 | v66.99,3.81 65.41,3.81 65.09,4.13 58.74,4.13 58.42,4.45 C2.1
  Bottom 0.152: v69.53,14.61 v66.67,11.75 66.67,4.13 v66.99,3.81
N$6  (via drill 0.35)
  Top 0.152: v35.88,8.89 38.42,8.89 42.23,12.7 R14.1
  Bottom 0.152: v35.88,8.89 34.61,7.62 D1.A
N$7  (via drill 0.35)
  Top 0.152: v70.17,13.34 70.17,15.56 U$4.2 | v68.58,11.43 67.31,10.16 X2.P$2 | v67.31,5.4 66.67,5.4 66.04,4.76 C4.1
  Bottom 0.152: v70.17,13.34 68.58,11.75 v68.58,11.43 68.58,6.67 v67.31,5.4
N$8  (via drill 0.35)
  Top 0.152: v35.88,24.13 40.96,24.13 44.77,20.32 R15.1
  Bottom 0.152: v35.88,24.13 34.61,25.4 D3.A
N$9  (via drill 0.35)
  Top 0.152: v23.81,30.16 23.81,27.94 C6.1 | v26.35,37.78 25.72,37.78 25.24,37.31 24.29,37.31 U10.11
  Bottom 0.152: v23.81,30.16 26.35,32.7 v26.35,37.78
N$10  (via drill 0.35)
  Top 0.152: v25.08,34.29 23.81,33.02 C17.1 17.46,33.02 17.46,36.35 18.1,36.99 18.73,36.99 18.89,37.15 U10.6
N$12  (via drill 0.35)
  Top 0.152: v51.44,53.98 U8.16
  Bottom 0.152: v51.44,53.98 52.07,54.61 J3.1
N$13
  Top 0.152: U8.15 52.7,52.07 54.29,52.07 54.61,51.75 54.61,48.9 51.44,48.9 50.8,49.53 50.8,54.61 53.34,54.61 J3.2
N$14
  Top 0.152: U8.14 53.98,49.21 52.39,49.21 52.07,49.53 52.07,54.29 54.61,54.29 54.93,54.61 55.88,54.61 J3.3
N$15
  Top 0.152: U8.13 55.24,54.29 58.1,54.29 J3.4
N$16
  Top 0.152: U9.16 66.67,55.88 J2.1
N$17
  Top 0.152: U9.15 67.94,54.61 68.58,54.61 J2.2
N$18
  Top 0.152: U9.14 69.22,54.61 71.12,54.61 J2.3
N$19
  Top 0.152: U9.13 70.48,54.29 73.34,54.29 J2.4
N$20
  Top 0.152: U11.16 81.92,55.88 J4.1
N$21
  Top 0.152: U11.15 83.19,55.88 J4.2
N$22
  Top 0.152: U11.14 84.45,54.61 85.09,54.61 J4.3
N$23
  Top 0.152: U11.13 85.72,54.61 87.63,54.61 J4.4
N$24
  Top 0.152: U12.16 36.2,55.88 J5.1
N$25
  Top 0.152: U12.15 37.47,54.61 38.1,54.61 J5.2
N$26
  Top 0.152: U12.14 38.73,54.61 40.64,54.61 J5.3
N$27
  Top 0.152: U12.13 40.01,54.29 42.86,54.29 J5.4
N$28
  Top 0.152: U13.16 95.89,55.88 J6.1
N$29
  Top 0.152: U13.15 97.16,55.88 J6.2
N$30
  Top 0.152: U13.14 98.42,54.61 99.06,54.61 J6.3
N$31
  Top 0.152: U13.13 99.69,54.61 101.6,54.61 J6.4
N$32
  Top 0.152: J7.1 7.3,55.88 7.3,49.21 12.06,44.45 D5.A
SCK  (via drill 0.35)
  Top 0.152: v101.28,13.34 100.33,13.34 U1.8 | v101.28,28.89 100.01,30.16 U4.12P | U2.6 89.53,34.92 89.85,35.24 100.65,35.24 101.6,34.29 101.6,30.48 100.01,30.48 U4.12P | 85.41,28.89 98.42,28.89 99.69,30.16 U4.12P | 85.41,28.89 69.53,28.89 68.9,28.26 59.05,28.26 59.05,29.53 59.37,29.84 63.82,29.84 63.82,33.02 IC1.3 | U$4.20 76.5,19.8 76.58,19.71 77.28,19.71 78.49,20.93 78.99,20.93 79.6,20.32 v86.36,20.32 | v86.36,27.94 85.41,28.89
  Bottom 0.152: v101.28,28.89 v101.28,13.34 | v86.36,27.94 v86.36,20.32
SCL  (via drill 0.35)
  Top 0.152: Q1.2 50.48,8.89 52.07,7.3 54.29,7.3 55.24,6.35 R1.2 55.56,6.35 55.88,6.67 v72.07,6.67 | U$4.32 71.49,22.67 71.49,23 71.12,23.37 v71.12,24.13 | v93.98,25.4 92.71,24.13 78.74,24.13 76.2,26.67 v69.85,26.67
  Bottom 0.152: v72.07,6.67 98.42,6.67 98.42,27.94 | 98.42,27.94 98.42,33.34 97.79,33.97 97.79,45.4 107.95,55.56 J8.1 | v71.12,24.13 69.85,25.4 v69.85,26.67 | v93.98,25.4 96.52,27.94 98.42,27.94
SCL_1V8  (via drill 0.35)
  Top 0.152: Q1.3 49.53,13.97 43.81,13.97 43.18,13.34 | 43.18,13.34 43.18,11.75 45.09,11.75 46.04,12.7 R9.1 | v35.88,17.94 38.58,17.94 43.18,13.34
  Bottom 0.152: v35.88,17.94 34.45,16.51 33.18,16.51 32.62,17.07 U5.2 32.7,17.15
SDA  (via drill 0.35)
  Top 0.152: U$4.31 72.07,22.54 v72.07,25.4 58,25.4 R10.2 56.52,24.13 55.56,23.18 51.75,23.18 Q2.2 | J8.2 108.58,53.98 v100.33,53.98
  Bottom 0.152: v100.33,53.98 82.87,36.51 80.64,36.51 80.64,33.02 73.03,25.4 v72.07,25.4
SDA_1V8  (via drill 0.35)
  Top 0.152: 51.28,25.88 52.07,26.67 R4.1 | 51.28,25.88 50.8,25.4 Q2.3 | 51.28,25.88 54.93,25.88 55.09,26.03 55.09,27.31 51.75,30.64 31.27,30.64 30.8,30.16 30.8,28.26 31.11,27.94 v31.11,16.51
  Bottom 0.152: v31.11,16.51 31.75,15.88 U5.8
SWCLK
  Top 0.152: TP1.P$1 63.5,17.78 68.9,17.78 U$4.45
SWDIO
  Top 0.152: U$4.46 68.77,17.15 68.44,17.15 65.26,13.97 TP2.P$1
VBAT  (via drill 0.35)
  Top 0.152: 13.65,46.99 12.38,48.26 D2.A | 13.65,46.99 25.08,46.99 26.35,48.26 26.35,49.53 X1.2 | C3.1 14.29,25.4 13.02,24.13 4.13,24.13 4.13,7.3 9.84,1.59 85.09,1.59 85.09,4.76 89.22,8.89 R3.1 | C3.1 13.34,31.75 12.38,32.7 U3.3 12.38,33.02 12.7,33.02 v13.34,33.66 | C3.1 | v13.65,42.23 13.65,46.99
  Bottom 0.152: v13.65,42.23 13.34,41.91 v13.34,33.66
VBUS  (via drill 0.35, 0.35 pad 0.27)
  Top 0.152: 15.88,40.64 15.88,44.45 D5.C | 15.88,40.64 C16.1 17.14,40.64 17.78,41.28 30.8,41.28 v33.66,38.42 34.61,39.37 L1.1 | 8.26,39.69 5.4,39.69 4.45,40.64 C19.1 4.13,40.64 4.13,35.88 4.45,35.56 6.03,35.56 6.03,30.8 7.62,29.21 11.75,29.21 12.7,28.26 CHG.A 12.7,25.4 C7.1 v10.16,25.4 | 8.26,39.69 9.21,40.64 C13.1 | 11.75,36.51 8.57,39.69 8.26,39.69 | 11.75,36.51 12.38,35.88 U3.4 | 11.75,36.51 15.88,40.64 | v23.18,48.26 D2.C 15.82,48.95 v15.24,49.53 | 29.21,36.51 v27.94,36.51 27.3,37.15 25.56,37.15 25.08,36.67 24.29,36.67 U10.10 | X3.VBUS 15.27,52.04 v16.51,50.8 | U6.1 6.64,10.05 12.21,15.62 12.21,21.59 10.95,22.86 v10.16,22.86 | v29.53,32.39 29.53,30 U7.1
  Bottom 0.152: v33.66,38.42 33.66,37.78 | 33.66,37.78 33.66,36.51 29.53,36.51 | 33.66,37.78 v23.18,48.26 | 29.53,36.51 v27.94,36.51 | v16.51,50.8 v15.24,49.53 | 29.53,36.51 v29.53,32.39 | v10.16,25.4 v10.16,22.86
VDDCORE
  Top 0.152: U$4.43 67.14,18.8 C1.1
XLAT  (via drill 0.35)
  Top 0.152: v63.5,42.23 63.5,40.96 63.82,40.64 IC1.30 | U$4.28 73.66,22.54 73.66,24.67 72.3,26.03 v67.63,26.03
  Bottom 0.152: v67.63,26.03 63.5,30.16 v63.5,42.23

## Text on the board
tPlace: NASA LSpace Group 21 | Control PCB | Designed by Shawn Joseph